# Altium schematic sheet MCU.SchDoc: H-Watch MCH
size A3; DrawnBy: schuluka; Organization: ETH-PBL; DocumentNumber: SCH4V0.2; Revision: V0.2; SheetNumber: 4; SheetTotal: 5
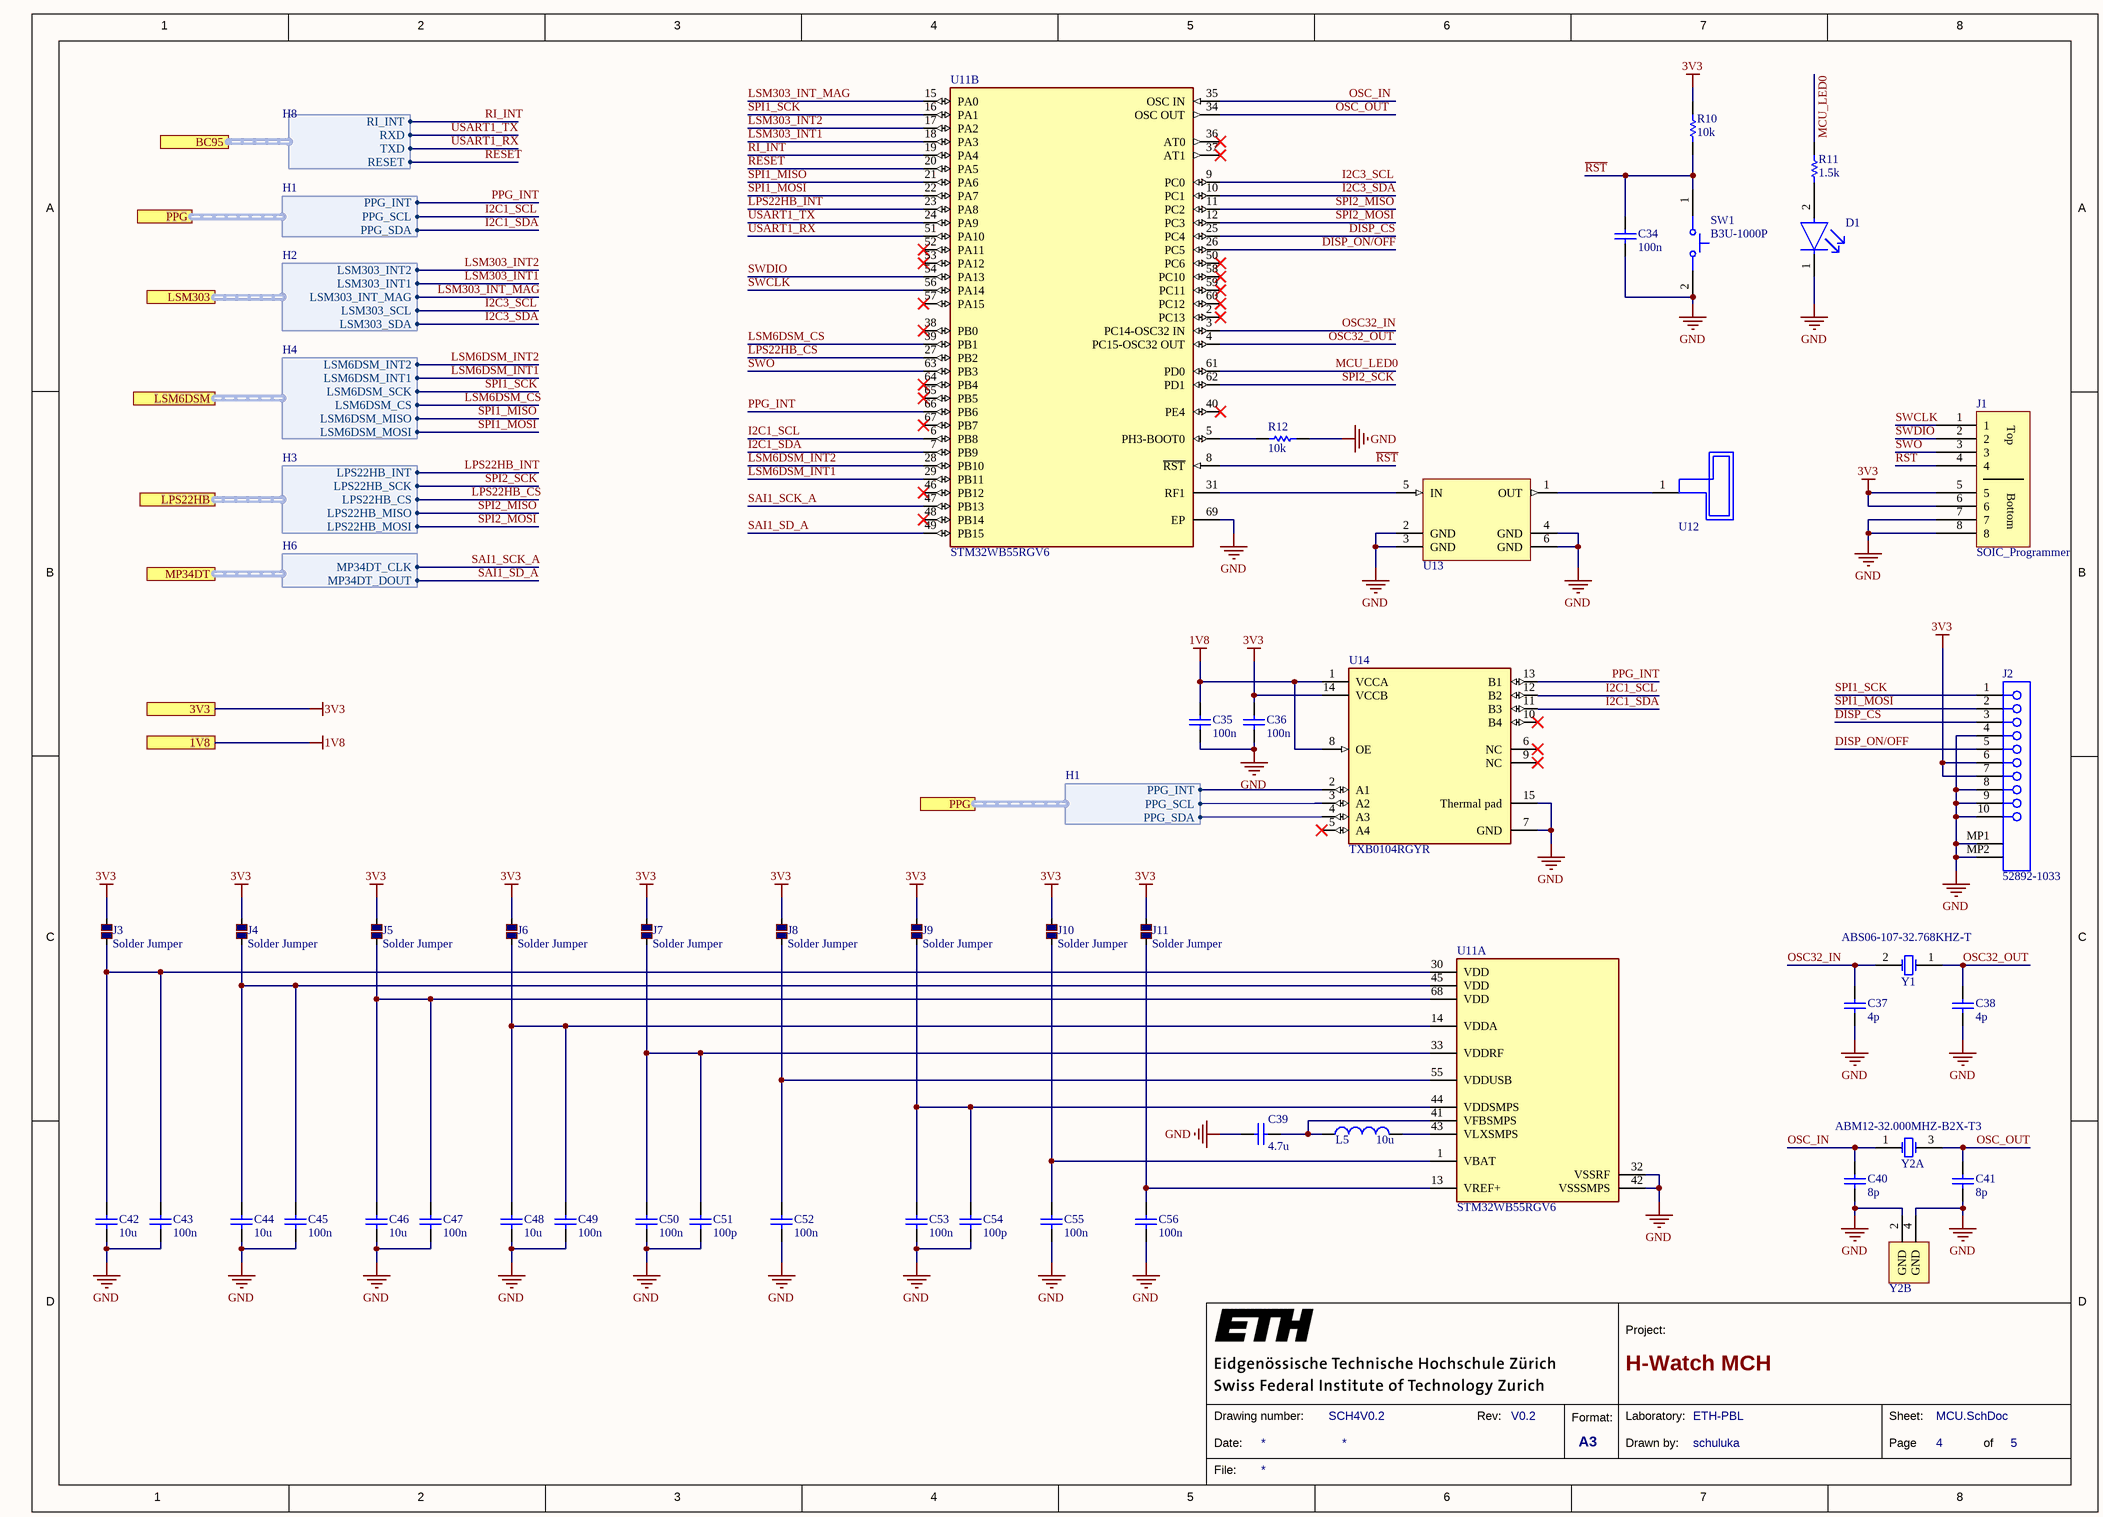
[diagram p0: MCU.SchDoc]

## Parts
C34  100n  [CAPC1005X60X30ML05T10]
C35  100n  [CAPC1005X60X30ML05T10]
C36  100n  [CAPC1005X60X30ML05T10]
C37  4p  [CAPC1005X55X25ML05T10]
C38  4p  [CAPC1005X55X25ML05T10]
C39  4.7u  [CAPC1608X90X20ML10]
C40  8p  [CAPC1005X55X25NL05T10]
C41  8p  [CAPC1005X55X25NL05T10]
C42  10u  [CAPC1005X70X10NL05]
C43  100n  [CAPC1005X60X30ML05T10]
C44  10u  [CAPC1005X70X10NL05]
C45  100n  [CAPC1005X60X30ML05T10]
C46  10u  [CAPC1005X70X10NL05]
C47  100n  [CAPC1005X60X30ML05T10]
C48  10u  [CAPC1005X70X10NL05]
C49  100n  [CAPC1005X60X30ML05T10]
C50  100n  [CAPC1005X60X30ML05T10]
C51  100p  [CAPC1005X56X25ML10T15]
C52  100n  [CAPC1005X60X30ML05T10]
C53  100n  [CAPC1005X60X30ML05T10]
C54  100p  [CAPC1005X56X25ML10T15]
C55  100n  [CAPC1005X60X30ML05T10]
C56  100n  [CAPC1005X60X30ML05T10]
D1  SML-P11VTT86R  [FP-SML-P1-MFG]  (value not drawn)
J1  SOIC_Programmer  [Programmer]
J2  52892-1033  [MOLX-52892-1033]
J3  Solder Jumper  [Small Solder Jumper]
J4  Solder Jumper  [Small Solder Jumper]
J5  Solder Jumper  [Small Solder Jumper]
J6  Solder Jumper  [Small Solder Jumper]
J7  Solder Jumper  [Small Solder Jumper]
J8  Solder Jumper  [Small Solder Jumper]
J9  Solder Jumper  [Small Solder Jumper]
J10  Solder Jumper  [Small Solder Jumper]
J11  Solder Jumper  [Small Solder Jumper]
L5  10u  [MURA-IND0805_L]
R10  10k  [RESC1005X40X25LL05T05]
R11  1.5k  [RESC1005X40X25ML05T10]
R12  10k  [RESC1005X40X25LL05T05]
SW1  B3U-1000P  [OMRON-B3U-1000_V]
U11  STM32WB55RGV6  [FP-VFQFPN-68-B029-MFG]  (parts A,B of 2)
U12  AMCA31-2R450G-S1F-T3  [AMCA31]  (value not drawn)
U13  MLPF-WB55-01E3  [MLPF-WB55-01E3]  (value not drawn)
U14  TXB0104RGYR  [FP-RGY0014A-MFG]
Y1  ABS06-107-32.768KHZ-T  [DFN140P200X60-2N-ABS06]
Y2  ABM12-32.000MHZ-B2X-T3  [ABM12]  (parts A,B of 2)

## Ports
1V8, 3V3, BC95 (harness H8), LPS22HB (harness H3), LSM6DSM (harness H4), LSM303 (harness H2), MP34DT (harness H6), PPG (harness H1)

## Harnesses
H2: LSM303_SDA, LSM303_SCL, LSM303_INT_MAG, LSM303_INT1, LSM303_INT2
H3: LPS22HB_MOSI, LPS22HB_MISO, LPS22HB_CS, LPS22HB_SCK, LPS22HB_INT
H4: LSM6DSM_MOSI, LSM6DSM_MISO, LSM6DSM_CS, LSM6DSM_SCK, LSM6DSM_INT1, LSM6DSM_INT2
H6: MP34DT_DOUT, MP34DT_CLK
H1: PPG_SDA, PPG_SCL, PPG_INT
H8: RESET, TXD, RXD, RI_INT

## Nets
1V8: C35.2 U14.1(VCCA) U14.8(OE) ; port 1V8
3V3: C36.2 J1.5 J1.6 J2.6 J2.7 J3.2 J4.2 J5.2 J6.2 J7.2 J8.2 J9.2 J10.2 J11.2 R10.2 U14.14(VCCB) ; port 3V3
GND: C34.1 C35.1 C36.1 C37.1 C38.2 C39.1 C40.1 C41.1 C42.1 C43.1 C44.1 C45.1 C46.1 C47.1 C48.1 C49.1 C50.1 C51.1 C52.1 C53.1 C54.1 C55.1 C56.1 D1.1(C) J1.7 J1.8 J2.4 J2.8 J2.9 J2.10 J2.MP1 J2.MP2 R12.1 SW1.2 U11.32(VSSRF) U11.42(VSSSMPS) U11.69(EP) U13.2(GND) U13.3(GND) U13.4(GND) U13.6(GND) U14.7(GND) U14.15(Thermal_pad) Y2.2(GND) Y2.4(GND)
DISP_CS: J2.3 U11.25(PC4)
DISP_ON/OFF: J2.5 U11.26(PC5)
I2C1_SCL: U11.6(PB8) U14.3(A2) ; port PPG.PPG_SCL
I2C1_SDA: U11.7(PB9) U14.4(A3) ; port PPG.PPG_SDA
I2C3_SCL: U11.9(PC0) ; port LSM303.LSM303_SCL
I2C3_SDA: U11.10(PC1) ; port LSM303.LSM303_SDA
LPS22HB_CS: U11.27(PB2) ; port LPS22HB.LPS22HB_CS
LPS22HB_INT: U11.23(PA8) ; port LPS22HB.LPS22HB_INT
LSM6DSM_CS: U11.39(PB1) ; port LSM6DSM.LSM6DSM_CS
LSM6DSM_INT1: U11.29(PB11) ; port LSM6DSM.LSM6DSM_INT1
LSM6DSM_INT2: U11.28(PB10) ; port LSM6DSM.LSM6DSM_INT2
LSM303_INT1: U11.18(PA3) ; port LSM303.LSM303_INT1
LSM303_INT2: U11.17(PA2) ; port LSM303.LSM303_INT2
LSM303_INT_MAG: U11.15(PA0) ; port LSM303.LSM303_INT_MAG
MCU_LED0: R11.2 U11.61(PD0)
OSC32_IN: C37.2 U11.3(PC14-OSC32_IN) Y1.2(X2)
OSC32_OUT: C38.1 U11.4(PC15-OSC32_OUT) Y1.1(X1)
OSC_IN: C40.2 U11.35(OSC_IN) Y2.1(X1)
OSC_OUT: C41.2 U11.34(OSC_OUT) Y2.3(X2)
PPG_INT: U11.66(PB6) U14.2(A1) U14.13(B1) ; port PPG.PPG_INT
~{RST}: C34.2 J1.4 R10.1 SW1.1 U11.8(~{RST})
RESET: U11.20(PA5) ; port BC95.RESET
RI_INT: U11.19(PA4) ; port BC95.RI_INT
SAI1_SCK_A: U11.47(PB13) ; port MP34DT.MP34DT_CLK
SAI1_SD_A: U11.49(PB15) ; port MP34DT.MP34DT_DOUT
SPI1_MISO: U11.21(PA6) ; port LSM6DSM.LSM6DSM_MISO
SPI1_MOSI: J2.2 U11.22(PA7) ; port LSM6DSM.LSM6DSM_MOSI
SPI1_SCK: J2.1 U11.16(PA1) ; port LSM6DSM.LSM6DSM_SCK
SPI2_MISO: U11.11(PC2) ; port LPS22HB.LPS22HB_MISO
SPI2_MOSI: U11.12(PC3) ; port LPS22HB.LPS22HB_MOSI
SPI2_SCK: U11.62(PD1) ; port LPS22HB.LPS22HB_SCK
SWCLK: J1.1 U11.56(PA14)
SWDIO: J1.2 U11.54(PA13)
SWO: J1.3 U11.63(PB3)
USART1_RX: U11.51(PA10) ; port BC95.TXD
USART1_TX: U11.24(PA9) ; port BC95.RXD
NetC39_2: C39.2 L5.1 U11.41(VFBSMPS)
NetC42_2: C42.2 C43.2 J3.1 U11.30(VDD)
NetC44_2: C44.2 C45.2 J4.1 U11.45(VDD)
NetC46_2: C46.2 C47.2 J5.1 U11.68(VDD)
NetC48_2: C48.2 C49.2 J6.1 U11.14(VDDA)
NetC50_2: C50.2 C51.2 J7.1 U11.33(VDDRF)
NetC52_2: C52.2 J8.1 U11.55(VDDUSB)
NetC53_2: C53.2 C54.2 J9.1 U11.44(VDDSMPS)
NetC55_2: C55.2 J10.1 U11.1(VBAT)
NetC56_2: C56.2 J11.1 U11.13(VREF+)
NetD1_2: D1.2(A) R11.1
NetL5_2: L5.2 U11.43(VLXSMPS)
NetR12_2: R12.2 U11.5(PH3-BOOT0)
NetU11_31: U11.31(RF1) U13.5(IN)
NetU12_1: U12.1 U13.1(OUT)

Not connected (* = marked no-connect by the designer): U11 2(PC13)* 36(AT0)* 37(AT1)* 38(PB0)* 40(PE4)* 46(PB12)* 48(PB14)* 50(PC6)* 52(PA11)* 53(PA12)* 57(PA15)* 58(PC10)* 59(PC11)* 60(PC12)* 64(PB4)* 65(PB5)* 67(PB7)*; U14 5(A4)* 6(NC)* 9(NC)* 10(B4)* 11(B3) 12(B2)

## Notes on the sheet
- 1
- 2
- 3
- 4
- 5
- 6
- 7
- 8
- A
- B
- C
- D
- Project:
- Date:
- Drawing number:
- Rev:
- Format:
- A3
- Drawn by:
- Laboratory:
- Page
- Sheet:
- of
- File:
- (in symbol SOIC_Programmer) Top; Bottom

## Library data of the parts
C34-C36 C43 C45 C47 C49 C50 C52 C53 C55 C56 = CMP-2008-02046-1: Manufacturer: Kemet; Part Number: C0402C104K8PACTU
C37 C38 = CMP-2008-03855-1: Manufacturer: Murata; Part Number: GJM1555C1H4R0CB01D
C39 = CMP-2000-04981-1: CAP, Ceramic, 4.7 uF, +/- 10%, 16 V, -55 to 85 degC, 0603 (1608 Metric), RoHS, Tape and Reel; Manufacturer: TDK; PCN Part Number: MLCCPartNumberChange30/Nov/2012; Other Names: 445-7478-1; Product Training Modules: CSeriesGeneralApplicationsSEAT,CCV,andTVCLDesignToolsGuidetoReplacinganElectrolyticCapacitorwithanMLCC; Design Resources: 20WNon-IsolatedBuckLEDDriverUsingPLLNK460KG; Online Catalog: CSeries,GeneralPurpose; Temperature Coefficient: X5R; Kits: 445-9003-KIT-ND-KITCAPCERHICAPMLCCSMD; Voltage - Rated: 16V; Capacitance: 4.7µF; Manufacturer URL: http://www.tdk.com/; Applications: GeneralPurpose; Height - Seated (Max): -; Mounting Type: SurfaceMount,MLCC; Lead Style: -; Packaging: CutTape(CT); Datasheet Version: Mar-15; Features: -; Ratings: -; Package / Case: 0603(1608Metric); Thickness (Max): 0.035"(0.90mm); Datasheet URL: http://download.siliconexpert.com/pdfs/2015/4/21/15/54/45/779/tdk_/manual/37024850441143360mlcc_commercial_general_en.pdf; Category: Capacitors; Family: CeramicCapacitors; Operating Temperature: -55degC~85degC; Size / Dimension: 0.063"Lx0.031"W(1.60mmx0.80mm); RoHS Information: RoHSCertificate-MLCC; Lead Spacing: -; Package Description: 2-Pin Surface Mount Device, Body 1.6 x 0.8 mm; Tolerance: ±10%; Series: C; Standard Package: 1; Package Reference: 603
C40 C41 = CMP-2008-03759-1: Manufacturer: Murata; Part Number: GJM1555C1H8R0CB01D
C42 C44 C46 C48 = CMP-2000-05993-1: Chip Capacitor, 10 uF, +/- 20%, -55 to 85 degC, 0402 (1005 Metric), RoHS, Tape and Reel; PCN Part Number: MLCCPartNumberChange30/Nov/2012; Manufacturer: TDK; Voltage - Rated: 6.3V; Capacitance: 10µF; Product Training Modules: CSeriesGeneralApplicationsSEAT,CCV,andTVCLDesignToolsGuidetoReplacinganElectrolyticCapacitorwithanMLCC; Online Catalog: CSeries,GeneralPurpose; Kits: 445-9021-KIT-ND-KITMLCC100PF-10UF04026.3-50V445-9003-KIT-ND-KITCAPCERHICAPMLCCSMD; Temperature Coefficient: X5R; Other Names: 445-8920-1; Standard Package: 1; Datasheet URL: http://download.siliconexpert.com/pdfs/2015/4/21/15/54/45/779/tdk_/manual/37024850441143360mlcc_commercial_general_en.pdf; Package Description: 2-Pin Surface Mount Device, Body 1.00 x 0.50 mm; Lead Style: -; RoHS Information: RoHSCertificate-MLCC; Mounting Technology: SurfaceMount; Manufacturer URL: http://www.tdk.com/; Packaging: CutTape(CT); Series: C; Category: Capacitors; Operating Temperature: -55°C~85°C; Ratings: -; Applications: GeneralPurpose; Lead Spacing: -; Family: CeramicCapacitors; Mounting Type: SurfaceMount,MLCC; Package / Case: 0402(1005Metric); Features: -; Thickness (Max): 0.020"(0.50mm); Size / Dimension: 0.039"Lx0.020"W(1.00mmx0.50mm); Datasheet Version: 03/2015; Package Reference: 0402; Tolerance: ±20%; Height - Seated (Max): -
C51 C54 = CMP-2008-02567-1: Part Number: 04025A101FAT2A.; Manufacturer: AVX Interconnect / Elco
D1 = CMP-08952-000003-1: LED RED CLEAR 1006 SMD; Manufacturer: Rohm; Led Orientation: Top View; Power Dissipation: 50mW; Wavelength: 626nm; Forward Voltage: 1.8V; Forward Current: 1mA; Luminous Intensity: 4mcd; Reverse Voltage: 5V; ComponentLink2URL: https://www.rohm.com/datasheet/SML-P11VT(R)/sml-p11-e; Temperature: -40°C to +85°C; Device Class L2: LEDs; Package: SML-P1; Category: Diode; Automotive: No; RoHS: TRUE; Lead Free: Yes; Digikey Description: LED RED CLEAR 1006 SMD; Manufacturer Part Number: SML-P11VTT86R; Device Class L3: unset; ComponentLink2Description: Datasheet; Octopart: https://octopart.com/sml-p11vtt86r-rohm-34112314; Device Class L1: Optoelectronics; Temperature Range High: +85°C; Temperature Range Low: -40°C; Mouser Description: SML-P11 Series Red 0402 Clear 4 mcd 1.8 V Surface Mount PICOLED? LED; Height: 0.25mm; Colour: Red
J2 = CMP-1241-00463-1: 0.5 mm Pitch Easy-On(TM) Type FPC Connector, 2.0 mm Mated Height, Right Angle, ZIF, SMT, Bottom Contact, 10 Circuits, -40 to 85 degC, ELV and RoHS Compliant, Tape and Reel; Manufacturer: Molex; Stackable: No; Material - Plating Termination: Silver, Tin-Bismuth; PCB Retention: Yes; Material - Metal: Phosphor Bronze; Mated Height: 2.00mm; Voltage (Max): 50V; Current (Max per Contact): 0.5A; Circuits (Loaded): 10; Durability (mating cycles max): 20; Pitch - Mating Interface: 0.50mm; Entry Angle: 90degrees Angle; PCB Locator: No; ComponentLink1Description: Manufacturer URL; PartNumber: 52892-1033; ComponentLink2URL: http://www.molex.com/webdocs/datasheets/pdf/en-us/0528921033_FFC_FPC_CONNECTORS.pdf; Orientation: Right Angle; Mounting Technology: Surface Mount; Material - Plating Mating: Silver, Tin-Bismuth; Contact Position: Bottom; PackageVersion: Rev. A, 05/2013; ComponentLink3Description: Package Specification; ComponentLink3URL: http://www.molex.com/pdm_docs/sd/528921033_sd.pdf; PackageDescription: 10-Lead FPC Connector, Pitch 0.5 mm; RoHS: TRUE; Polarized to PCB: No; ComponentLink1URL: http://www.molex.com/molex/index.jsp; Number of Rows: 1; ComponentLink2Description: Datasheet; Packing: Tape and Reel; PackageReference: 52892-1033; Pitch - Termination Interface: 0.50mm
J3-J11 = CMP-00005-5: Value: 1; Technology: SMT
L5 = CMP-2000-06587-1: Fixed Inductor, 10 uH, +/-20%, -55 to 125 degC, 2-Pin SMD (0805), RoHS, Tape and Reel; Manufacturer: Murata; Tolerance (%): 20%; DC Resistance: 0.6; Inductance-Nom: 10H; Rated Current-Max: 100mA; Package Reference: IND0805; Case Size/Dimension: 0805; Manufacturer URL: http://www.murata.com/; Package Description: 2-Pin Surface Mount Device, Body 2 x 1.25 mm; Datasheet URL: http://psearch.en.murata.com/inductor/product/LQM21FN100M70%23.pdf; Mounting Technology: SurfaceMount; Datasheet Version: 05/2016
R10 R12 = CMP-2000-07588-1: Chip Resistor, 10 KOhm, +/- 1%, 0.1 W, -55 to 155 degC, 0402 (1005 Metric), RoHS, Tape and Reel; Manufacturer: Panasonic; Power Rating: 100mW; Voltage Rating: 50V; Resistance: 10KOhm; Case\/Package: 0402; Temperature Coefficient: 100ppm\/degreesC; RoHSCompliant: True; Lead Free: LeadFree; Package Quantity: 1; Contact Plating: Tin; Length: 1mm; Radiation Hardening: No; REACH SVHC: NoSVHC; Max Operating Temperature: 155degC; Depth: 0.5mm; Case Code (Imperial): 0402; Military Standard: Not; Package Description: 2-Pin Surface Mount Device, Body 1 x 0.5 mm; Termination: SMD/SMT; Case Code (Metric): 1005; Height: 0.35mm; Packaging: TapeandReel; Voltage Rating (DC): 50V; Package Reference: 402; Number of Pins: 2; Tolerance: 1%; Mounting Technology: SurfaceMount; Width: 0.02inch; Mount: SurfaceMount; Datasheet URL: https://industrial.panasonic.com/cdbs/www-data/pdf/RDA0000/AOA0000C304.pdf; Composition: ThickFilm; Datasheet Version: 02/2017; Manufacturer URL: http://www.panasonic.com/; Max Power Dissipation: 100mW; Number of Terminations: 2; Min Operating Temperature: -55degC
R11 = CMP-2002-07464-1: Manufacturer: Yageo / Phycomp; Part Number: RC0402FR-071K5L
SW1 = CMP-2100-03586-1: Ultra-Small Tactile Switch, 0.05 A, 12 V, -25 to 70 degC, 2-Pin SMD, RoHS, Tape and Reel; Manufacturer: Omron Electronic Components; Operating Force: 1.5N; Current Rating: 50mA; Voltage Rating (DC): 12V; Electrical Life: 200000Cycles; Actuator Length: 0.4mm; Insulation Resistance: 100MOhm; Switch Travel: 0.15mm; Throw Configuration: SPST; Illumination Type: Illuminated; Width: 3mm; Weight: 0.022g; Datasheet Version: 42005.0; Datasheet URL: http://www.omron.com/ecb/products/pdf/en-b3u.pdf; Height: 1.2mm; Package Quantity: 1; REACH SVHC: Unknown; Contact Current Rating: 50mA; Contact Material: Silver; Max Current Rating: 50mA; Package Reference: B3U-1000; Termination: SMD/SMT; Packaging: TapeandReel; Manufacturer URL: http://www.omron.com/; RoHSCompliant: true; Mount: SurfaceMount; Length: 4mm; Min Operating Temperature: -25degC; Depth: 2.5mm; Lead Free: LeadFree; Case/Package: SMD/SMT; Package Description: 2-Pin Surface Mount Device, Body 3 x 2.5 mm; Max Operating Temperature: 70degC; Orientation: Straight
U11 = CMP-12160-000001-1: ULTRA-LOW-POWER DUAL CORE ARM CO; Manufacturer: STMicroelectronics; Max Junction Temp: +125°C; Bandwidth: 75MHz; Max Frequency: 2480MHz; Sensitivity: -96dBm; Number Of Adc Channels: 19; Receiving Current: 4.5-7.9mA; Interface: I2C,SPI,UART,USART,USB; Data Rate: 2Mbits/s; Number Of Gpio: 49; Min Supply Voltage: 1.71V; Max Power Dissipation: 425mW; Max Supply Voltage: 3.6V; Standoff Height: 0mm; Octopart: https://octopart.com/stm32wb55rgv6-stmicroelectronics-98750848; Category: IC; Digikey Description: ULTRA-LOW-POWER DUAL CORE ARM CO; Height: 1mm; Device Class L2: RF Semiconductors and Devices; Automotive: No; Ambient Temperature Range High: +105°C; ComponentLink2Description: Datasheet; Ambient Temperature Range Low: -40°C; Lead Free: Yes; Temperature Range Low: -40°C; Ipc Land Pattern Name: QFN40P800X800X90-68; Device Class L1: Integrated Circuits (ICs); Manufacturer Part Number: STM32WB55RGV6; Package: VFQFPN-68-B029; RoHS: TRUE; Temperature Range High: +125°C; ComponentLink2URL: https://www.st.com/resource/en/datasheet/stm32wb55rg.pdf; Temperature: -40°C to +125°C; Device Class L3: Transceivers; Mouser Description: MCU 32-Bit STM32WB55 ARM Cortex M4 RISC 1MB Flash 1.7V to 3.6V 68-Pin VFQFPN Tray
U12 = CMP-00950-1: Antennas 2.45GHz BW 90dB + Gain -1 dBi avg.; Impedance: 50R; Bandwidth: 90MHz; Power Rating: 3W; Number of Bands: 1; Mount: Surface Mount; Case/Package: SMD/SMT; Packaging: Tape and Reel; Package Quantity: 3000; Frequency: 2.45GHz; Max Power Dissipation: 3W; Termination: Solder; Max Frequency: 2.45GHz; Height: 0.047inch
U13 = CMP-01265-1: Prices include import duty and tax. RF FILTER, 2.4GHZ TO 2.5GHZ, WLCSP-6;; Filter Type: Low Pass; Bandwidth: 100MHz; Insertion Loss: 1.1dB; Frequency: 2.45GHz Center; Ripple: -; Package / Case: 6-SMD, No Lead; Mounting Type: Surface Mount
U14 = CMP-04899-000011-1: IC TRNSLTR BIDIRECTIONAL 14VQFN; Manufacturer: Texas Instruments; Standoff Height: 0mm; V B Min: 1.65V; Data Rate: 100Mbits/s; Number Of Circuits: 1; V B Max: 5.5V; Number Of Inputs: 4; Logic Function Desc: Non-Inverting; Max Junction Temp: +150°C; V A Min: 1.2V; Nominal Supply Current: 0.06-3.5uA; V A Max: 3.6V; Propagation Delay: 4ns; Device Class L1: Integrated Circuits (ICs); ComponentLink2Description: Datasheet; Mouser Description: 4-Bit Bidirectional Voltage-Level Shifter with Auto Direction Sensing and +/-15 kV ESD Protect 14-VQFN -40 to 85; Ambient Temperature Range Low: -40°C; Temperature: -40°C to +85°C; RoHS: TRUE; Digikey Description: IC TRNSLTR BIDIRECTIONAL 14VQFN; Manufacturer Part Number: TXB0104RGYR; Lead Free: Yes; Octopart: https://octopart.com/txb0104rgyr-texas+instruments-1485948; Height: 1mm; Device Class L3: Voltage Level Shifters; Category: IC; Device Class L2: Logic ICs; Temperature Range Low: -40°C; Number Of Outputs: 4; Temperature Range High: +85°C; Package: RGY0014A; Automotive: No; Ambient Temperature Range High: +85°C; Min Supply Voltage: 1.2V; ComponentLink2URL: http://www.ti.com/lit/ds/symlink/txb0104.pdf; Max Supply Voltage: 5.5V
Y1 = CMP-00140-1: CRYSTAL 32.7680KHZ 4PF SMD; Manufacturer: Abracon LLC; Frequency Tolerance: ±20ppm; ESR (Equivalent Series Resistance): 60 kOhm; Operating Mode: Fundamental; Packaging: Cut Tape (CT); Type: kHz Crystal (Tuning Fork); Frequency: 32.768kHz; Frequency Stability: -; Load Capacitance: 4pF; Operating Temperature: -40°C ~ 85°C; Ratings: -; Mounting Type: Surface Mount; Package / Case: 0805 (2012 Metric); Size / Dimension: 0.079" L x 0.047" W (2.00mm x 1.20mm); Height: 0.024" (0.60mm); Manufacturer Part Number: ABS06-107-32.768KHZ-T; Supplier: Digi-Key; Supplier Part Number: 535-12373-1-ND; ComponentLink1Description: ABS06-107-32.768kHz-T.pdf; ComponentLink1URL: http://www.abracon.com/Resonators/ABS06-107-32.768kHz-T.pdf
Y2 = CMP-00975-1: 32MHz ±20ppm Crystal 8pF 200 Ohm -20°C ~ 70°C  Surface Mount 4-SMD, No Lead (DFN, LCC); ESR (Equivalent Series Resistance): 200R; Case/Package: CSMD; Number of Pins: 4; Min Operating Temperature: -20°C; Max Operating Temperature: 70°C; Frequency: 32MHz; Packaging: Tape and Reel; Load Capacitance: 8pF; Package Quantity: 3000; Frequency Tolerance: 20ppm; Tolerance: 20ppm; Frequency Stability: 20ppm; Termination: SMD/SMT; Composition: Ceramic; Length: 1.6mm; Height: 0.018inch; Width: 0.047inch; Depth: 1.2mm; Radiation Hardening: No; REACH SVHC: No SVHC; Lead Free: Lead Free; Mount: Surface Mount; PartId: 1